# EAGLE schematic Buzz Box Schematic (EAGLE 9.6.2)
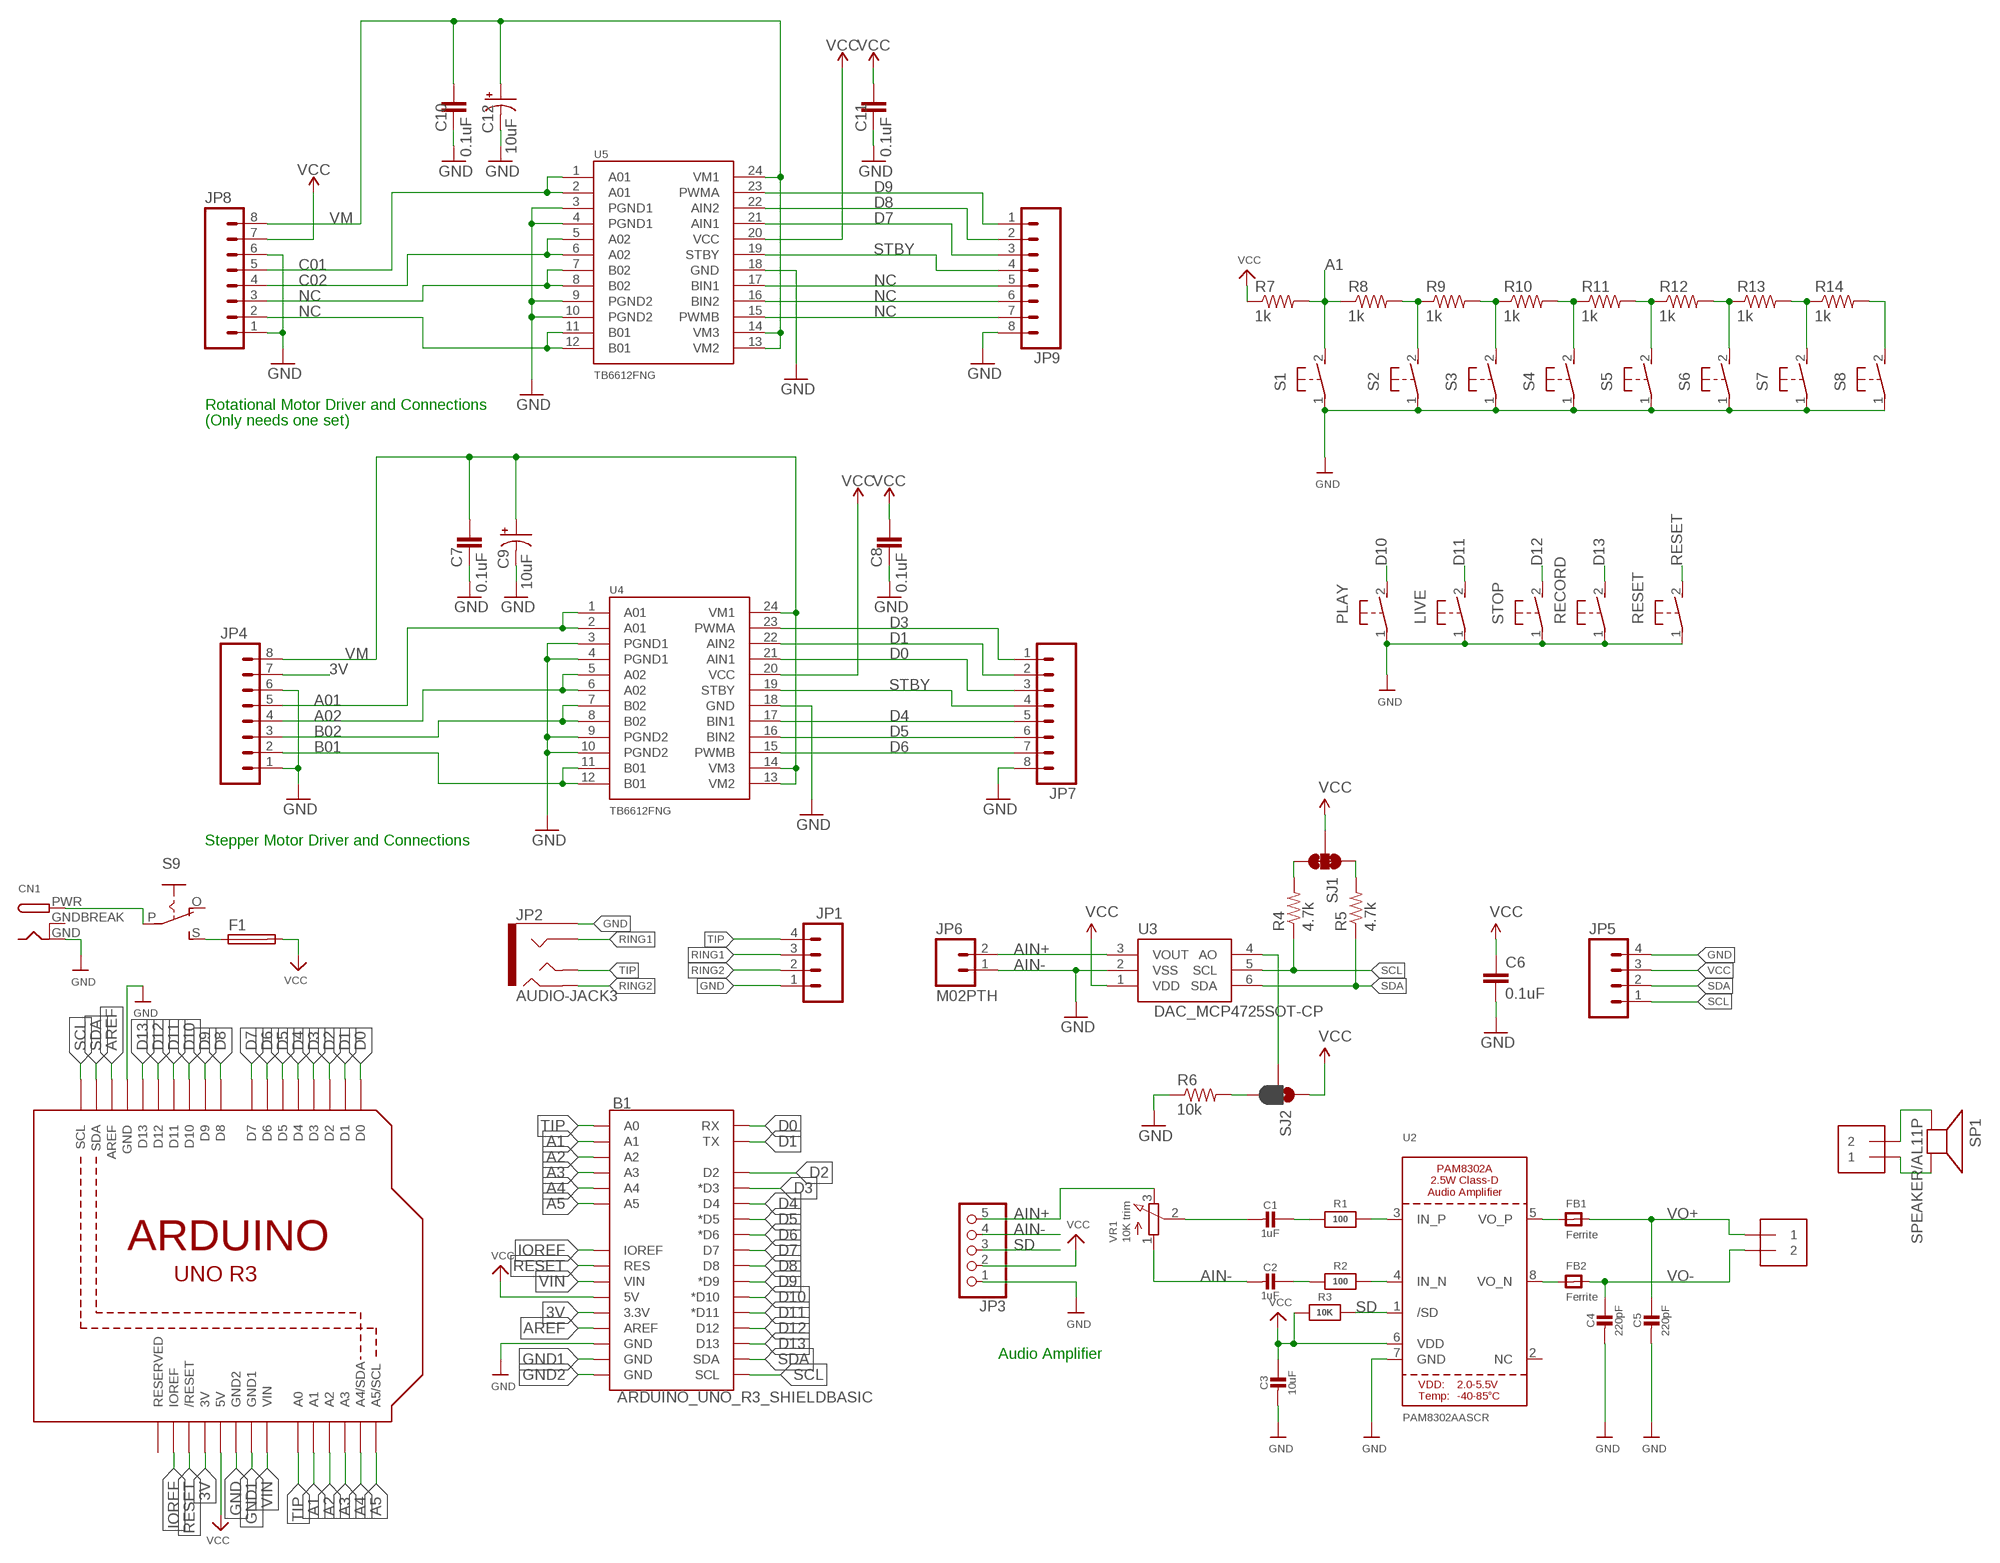
[diagram p0: schematic, sheet 1]

## Parts
B1  ARDUINO_UNO_R3_SHIELDBASIC  [UNO_R3_SHIELD]
C1  1uF  CAP_CERAMIC0805-NOOUTLINE  [0805-NO]
C2  1uF  CAP_CERAMIC0805-NOOUTLINE  [0805-NO]
C3  10uF  CAP_CERAMIC0805-NOOUTLINE  [0805-NO]
C4  220pF  CAP_CERAMIC0805-NOOUTLINE  [0805-NO]
C5  220pF  CAP_CERAMIC0805-NOOUTLINE  [0805-NO]
C6  0.1uF  CAP0603-CAP  [0603-CAP]
C7  0.1uF  0.1UF-0402-16V-10%  [0402]
C8  0.1uF  0.1UF-0402-16V-10%  [0402]
C9  10uF  10UF-POLAR-EIA3528-20V-10%(TANT)  [EIA3528]
C10  0.1uF  0.1UF-0402-16V-10%  [0402]
C11  0.1uF  0.1UF-0402-16V-10%  [0402]
C12  10uF  10UF-POLAR-EIA3528-20V-10%(TANT)  [EIA3528]
CN1  DCBARRELPTH  [DCJACK_2MM_PTH]
F1  19560  [19560]
FB1  Ferrite  FERRITE_0805  [_0805]
FB2  Ferrite  FERRITE_0805  [_0805]
JP1  M04PTH  [1X04]
JP2  AUDIO-JACK3  [AUDIO-JACK-TRRS-SMD]
JP3  HEADER-1X570MIL  [1X05_ROUND_70]
JP4  M0875_PERCENT_REDUCED  [1X08_OFFSET_REDUCED]
JP5  M04PTH  [1X04]
JP6  M02PTH  [1X02]
JP7  M0875_PERCENT_REDUCED  [1X08_OFFSET_REDUCED]
JP8  M0875_PERCENT_REDUCED  [1X08_OFFSET_REDUCED]
JP9  M0875_PERCENT_REDUCED  [1X08_OFFSET_REDUCED]
LIVE  31-XX  [B3F-31XX]
PLAY  31-XX  [B3F-31XX]
R1  100  RESISTOR0805_NOOUTLINE  [0805-NO]
R2  100  RESISTOR0805_NOOUTLINE  [0805-NO]
R3  10K  RESISTOR0805_NOOUTLINE  [0805-NO]
R4  4.7k  RESISTOR0603-RES  [0603-RES]
R5  4.7k  RESISTOR0603-RES  [0603-RES]
R6  10k  RESISTOR0603-RES  [0603-RES]
R7  1k  R-US_0817/22  [P0817/22]
R8  1k  R-US_0817/22  [P0817/22]
R9  1k  R-US_0817/22  [P0817/22]
R10  1k  R-US_0817/22  [P0817/22]
R11  1k  R-US_0817/22  [P0817/22]
R12  1k  R-US_0817/22  [P0817/22]
R13  1k  R-US_0817/22  [P0817/22]
R14  1k  R-US_0817/22  [P0817/22]
RECORD  31-XX  [B3F-31XX]
RESET  31-XX  [B3F-31XX]
S1  31-XX  [B3F-31XX]
S2  31-XX  [B3F-31XX]
S3  31-XX  [B3F-31XX]
S4  31-XX  [B3F-31XX]
S5  31-XX  [B3F-31XX]
S6  31-XX  [B3F-31XX]
S7  31-XX  [B3F-31XX]
S8  31-XX  [B3F-31XX]
S9  EG1218S  [EG1218]
SJ1  JUMPER-PAD-3-NC_BY_TRACE  [PAD-JUMPER-3-3OF3_NC_BY_TRACE_YES_SILK_FULL_BOX]
SJ2  JUMPER-PAD-3-2OF3_NC_BY_PASTE  [PAD-JUMPER-3-2OF3_NC_BY_PASTE_YES_SILK_FULL_BOX]
SP1  SPEAKER/AL11P  [AL11P]
STOP  31-XX  [B3F-31XX]
U1  ARDUINOR3-BPLACE  [ARDUINOR3-BPLACE]
U2  PAM8302AASCR  AUDIOAMP_PAM8302A  [MSOP8_0.65MM]
U3  DAC_MCP4725SOT-CP  [SOT23-6-MCP4725]
U4  TB6612FNG  [SSOP24]
U5  TB6612FNG  [SSOP24]
VR1  10K trim  TRIMPOT3303W/X  [TRIMPOT_BOURNS_3303W]
X1  TERMBLOCK_1X2  [TERMBLOCK_1X2-3.5MM]
X2  TERMBLOCK_1X2  [TERMBLOCK_1X2-3.5MM]

## Nets
3V: B1.3.3V JP4.7 U1.3V
A1: B1.A1 R7.2 R8.1 S1.2(S) U1.A1
A01: JP4.5 U4.1(A01) U4.2(A01)
A2: B1.A2 U1.A2
A02: JP4.4 U4.5(A02) U4.6(A02)
A3: B1.A3 U1.A3
A4: B1.A4 U1.A4(A4/SDA)
A5: B1.A5 U1.A5(A5/SCL)
AIN+: JP3.5 JP6.2 U3.3(VOUT) VR1.3(E)
AIN-: C2.2 JP3.4 JP6.1 U3.2(VSS) VR1.1(A) ; supply symbol labelled GND
AREF: B1.AREF U1.AREF
B01: JP4.2 U4.11(B01) U4.12(B01)
B02: JP4.3 U4.7(B02) U4.8(B02)
C01: JP8.5 U5.1(A01) U5.2(A01)
C02: JP8.4 U5.5(A02) U5.6(A02)
D0: B1.RX JP7.3 U1.D0 U4.21(AIN1)
D1: B1.TX JP7.2 U1.D1 U4.22(AIN2)
D2: B1.D2 U1.D2
D3: B1.D3(*D3) JP7.1 U1.D3 U4.23(PWMA)
D4: B1.D4 JP7.5 U1.D4 U4.17(BIN1)
D5: B1.D5(*D5) JP7.6 U1.D5 U4.16(BIN2)
D6: B1.D6(*D6) JP7.7 U1.D6 U4.15(PWMB)
D7: B1.D7 JP9.3 U1.D7 U5.21(AIN1)
D8: B1.D8 JP9.2 U1.D8 U5.22(AIN2)
D9: B1.D9(*D9) JP9.1 U1.D9 U5.23(PWMA)
D10: B1.D10(*D10) PLAY.2(S) U1.D10
D11: B1.D11(*D11) LIVE.2(S) U1.D11
D12: B1.D12 STOP.2(S) U1.D12
D13: B1.D13 RECORD.2(S) U1.D13
GND: B1.GND@2(GND) C3.2 C4.2 C5.2 C6.2 C7.2 C8.2 C9.C(-) C10.2 C11.2 C12.C(-) CN1.GND JP1.1 JP2.EARTH JP3.1 JP4.1 JP4.6 JP5.4 JP7.8 JP8.1 JP8.6 JP9.8 LIVE.1(P) PLAY.1(P) R6.1 RECORD.1(P) RESET.1(P) S1.1(P) S2.1(P) S3.1(P) S4.1(P) S5.1(P) S6.1(P) S7.1(P) S8.1(P) STOP.1(P) U1.GND U1.GND2 U2.7(GND) U4.3(PGND1) U4.4(PGND1) U4.9(PGND2) U4.10(PGND2) U4.18(GND) U5.3(PGND1) U5.4(PGND1) U5.9(PGND2) U5.10(PGND2) U5.18(GND)
GND1: B1.GND@1(GND) U1.GND1
GND2: B1.GND@0(GND)
IOREF: B1.IOREF U1.IOREF
N$1: R2.2 U2.4(IN_N)
N$2: R1.2 U2.3(IN_P)
N$3: C1.1 R1.1
N$4: C2.1 R2.1
N$5: FB2.1 U2.8(VO_N)
N$6: FB1.1 U2.5(VO_P)
N$7: C1.2 VR1.2(S)
N$8: R5.2 SJ1.1
N$9: R4.2 SJ1.3
N$10: SJ2.2 U3.4(AO)
N$11: R6.2 SJ2.3
N$12: SP1.+ X2.2
N$13: SP1.- X2.1
N$14: CN1.PWR S9.P
N$15: R8.2 R9.1 S2.2(S)
N$16: R9.2 R10.1 S3.2(S)
N$17: R10.2 R11.1 S4.2(S)
N$18: R11.2 R12.1 S5.2(S)
N$19: R12.2 R13.1 S6.2(S)
N$20: R13.2 R14.1 S7.2(S)
N$21: R14.2 S8.2(S)
N$22: F1.1 S9.S
NC: JP8.2 JP8.3 JP9.5 JP9.6 JP9.7 U5.7(B02) U5.8(B02) U5.11(B01) U5.12(B01) U5.15(PWMB) U5.16(BIN2) U5.17(BIN1)
RESET: B1.RES RESET.2(S) U1.RESET(/RESET)
RING1: JP1.3 JP2.RING1
RING2: JP1.2 JP2.RING2
SCL: B1.SCL JP5.1 R4.1 U1.SCL U3.5(SCL)
SD: JP3.3 R3.2 U2.1(/SD)
SDA: B1.SDA JP5.2 R5.1 U1.SDA U3.6(SDA)
STBY: JP7.4 JP9.4 U4.19(STBY) U5.19(STBY)
TIP: B1.A0 JP1.4 JP2.TIP U1.A0
VCC: B1.5V C3.1 C6.1 C8.1 C11.1 F1.2 JP3.2 JP5.3 JP8.7 R3.1 R7.1 SJ1.2 SJ2.1 U1.5V U2.6(VDD) U3.1(VDD) U4.20(VCC) U5.20(VCC)
VIN: B1.VIN U1.VIN
VM: C7.1 C9.A(+) C10.1 C12.A(+) JP4.8 JP8.8 U4.13(VM2) U4.14(VM3) U4.24(VM1) U5.13(VM2) U5.14(VM3) U5.24(VM1)
VO+: C5.1 FB1.2 X1.1
VO-: C4.1 FB2.2 X1.2
Unconnected: S9.O U1.RESERVED U2.2(NC)

## Notes on the sheet
- Rotational Motor Driver and Connections
- (Only needs one set)
- Stepper Motor Driver and Connections
- Audio Amplifier

## Power pins joined to a net without a drawn wire
GNDBREAK: CN1.GNDBREAK

## Library data of the parts
B1 = SparkFun-Boards:ARDUINO_UNO_R3_SHIELD: Arduino R3 Shield Footprint Shield form compatible with the Arduino Uno R3. SparkFun Products: MG2639 Cellular Shield <https://www.sparkfun.com/products/13120> MIDI Shield <https://www.sparkfun.com/products/12898> R3 Stackable Headers Kit <https://www.sparkfun.com/products/11417>
C1-C5 = microbuilder:CAP_CERAMIC: Ceramic Capacitors For new designs, use the packages preceded by an '_' character since they are more reliable: The following footprints should be used on most boards: _0402 - Standard footprint for regular board layouts _0603 - Standard footprint for regular board layouts _0805 - Standard footprint for regular board layouts _1206 - Standard footprint for regular board layouts For extremely tight-pitch boards where space is at a premium, the following 'micro-pitch' footprints can be used (smaller pads, no silkscreen outline, etc.): _0402MP - Micro-pitch footprint for very dense/compact boards _0603MP - Micro-pitch footprint for very dense/compact boards _0805MP - Micro-pitch footprint for very dense/compact boards _1206MP - Micro-pitch footprint for very dense/compact boards
C6 = SparkFun:CAP: Capacitor Standard 0603 ceramic capacitor, and 0.1" leaded capacitor.
C7 C8 C10 C11 = SparkFun-Capacitors:0.1UF: 0.1µF ceramic capacitors A capacitor is a passive two-terminal electrical component used to store electrical energy temporarily in an electric field.; PROD_ID: CAP-12416
C9 C12 = SparkFun-Capacitors:10UF-POLAR: 10.0µF polarized capacitors A capacitor is a passive two-terminal electrical component used to store electrical energy temporarily in an electric field.; PROD_ID: CAP-08063
CN1 = adafruit:DCBARREL: 2.0mm DC Barrel Jack DCJACK_2MM_PTH - Through Hole Jack (4UConnector: 05537)
F1 = fuse:19560: FUSE HOLDER TR5, Wickmann; MPN: 56000001009; OC_FARNELL: 1185363; OC_NEWARK: 15P8392
FB1 FB2 = microbuilder:FERRITE: Ferrite Bead 0603 MMZ1608B121C - 120 Ohm @ 100MHz, 600mA, 0.15 Ohm DC Resistance - Digikey: 445-2164-1-ND BK1608HW121-T - 120 Ohm, 600mA Ferrite Chip - Digikey: 587-1876-2-ND 0805 HZ0805B272R-10 - 2.7K Ohm @ 100MHz, 200mA, 0.8 Ohm DC Resistance - Digikey: 240-2504-1-ND (see also Murata BLM21BD272SN1L) MMZ2012Y152B - 1.5K Ohm @ 100MHz, 500mA, 0.4 Ohm DC Resistance - Digikey: 445-1560-1-ND - Mainly for high frequency (80-400MHz) MMZ2012R102A - 1K Ohm @ 100MHz, 500mA, 0.3 Ohm DC Resistance - Digikey: 445-1555-2-ND - More general purpose (10-200MHz)
JP1 JP5 = SparkFun-Connectors:M04: Header 4 Standard 4-pin 0.1" header. Use with straight break away headers (SKU : PRT-00116), right angle break away headers (PRT-00553), swiss pins (PRT-00743), machine pins (PRT-00117), and female headers (PRT-00115). Molex polarized connector foot print use with SKU : PRT-08231 with associated crimp pins and housings. 1MM SMD Version SKU: PRT-10208
JP2 = SparkFun-Connectors:AUDIO-JACK3: Audio jack - 3.5mm TRRS variety - two rings.
JP3 = microbuilder:HEADER-1X5: PIN HEADER
JP4 JP7-JP9 = Testing:M08: Header 8 Standard 8-pin 0.1" header. Use with straight break away headers (SKU : PRT-00116), right angle break away headers (PRT-00553), swiss pins (PRT-00743), machine pins (PRT-00117), and female headers (PRT-00115).
JP6 = SparkFun-Connectors:M02: Standard 2-pin 0.1" header. Use with - straight break away headers ( PRT-00116) - right angle break away headers (PRT-00553) - swiss pins (PRT-00743) - machine pins (PRT-00117) - female headers (PRT-00115) Molex polarized connector foot print use with: PRT-08233 with associated crimp pins and housings. 2.54_SCREWTERM for use with PRT-10571. 3.5mm Screw Terminal footprints for PRT-08084 5mm Screw Terminal footprints for use with PRT-08433
LIVE PLAY RECORD RESET STOP = adafruit:31-XX: OMRON SWITCH Now with beefier pads!
R1-R3 = microbuilder:RESISTOR: Resistors For new designs, use the packages preceded by an '_' character since they are more reliable: The following footprints should be used on most boards: _0402 - Standard footprint for regular board layouts _0603 - Standard footprint for regular board layouts _0805 - Standard footprint for regular board layouts _1206 - Standard footprint for regular board layouts For extremely tight-pitch boards where space is at a premium, the following 'micro-pitch' footprints can be used (smaller pads, no silkscreen outline, etc.): _0402MP - Micro-pitch footprint for very dense/compact boards _0603MP - Micro-pitch footprint for very dense/compact boards _0805MP - Micro-pitch footprint for very dense/compact boards _1206MP - Micro-pitch footprint for very dense/compact boards
R4-R6 = SparkFun:RESISTOR: Resistor Basic schematic elements and footprints for 0603, 1206, and PTH resistors.
R7-R14 = rcl:R-US_: RESISTOR, American symbol; SPICEPREFIX: R
S1-S8 = adafruit:31-XX: OMRON SWITCH Now with beefier pads!; SPICEPREFIX: B
S9 = adafruit:EG1218: SLIDING SWITCH 0.1" spacing through hole, vertical SPDT slide switch http://www.ladyada.net/library/pcb/eaglelibrary.html
SJ1 = SparkFun-Passives:JUMPER-PAD-3-NC_BY_TRACE
SJ2 = SparkFun-Passives:JUMPER-PAD-3-2OF3_NC_BY_PASTE
SP1 = adafruit:SPEAKER: SPEAKER Source: Buerklin Added PS12 (for part # PS1240 piezo) http://www.ladyada.net/library/pcb/eaglelibrary.html
U1 = adafruit:ARDUINOR3: This is a new object for the new Arduino R3 - with extra pins that you may want to use (such as IOref, and duplicated A4/A5
U2 = microbuilder:AUDIOAMP_PAM8302A: PAM8302A - 2.5W Class-D Mono Audio Amplifier MSOP8 = PAM8302AASCR
U3 = SparkFun-AnalogIC:DAC_MCP4725: Microchip 12-bit I2C DAC, SOT23-6
U4 U5 = SparkFun-IC-Special-Function:TB6612FNG: Toshiba 1A dual motor driver IC-09363; PROD_ID: IC-09363
VR1 = microbuilder:TRIMPOT: 3-Pin SMT Trimpots Bourns TC33 (X-2) Series 1K - Digikey: TC33X-102ECT-ND 10K - Digikey: TC33X-2-103E 100K - Digikey: TC33X-104ECT-ND Bourns 3303 (W) Series 3mm 10K Single Turn - Digikey: 3303W-103ETR-ND 3mm 100K Single Turn - Digikey: 3303X-104ETR-ND
X1 X2 = microbuilder:TERMBLOCK_1X2: 3.5mm Terminal block http://www.ladyada.net/library/pcb/eaglelibrary.html